# EAGLE design Dipudino (EAGLE 5.11)
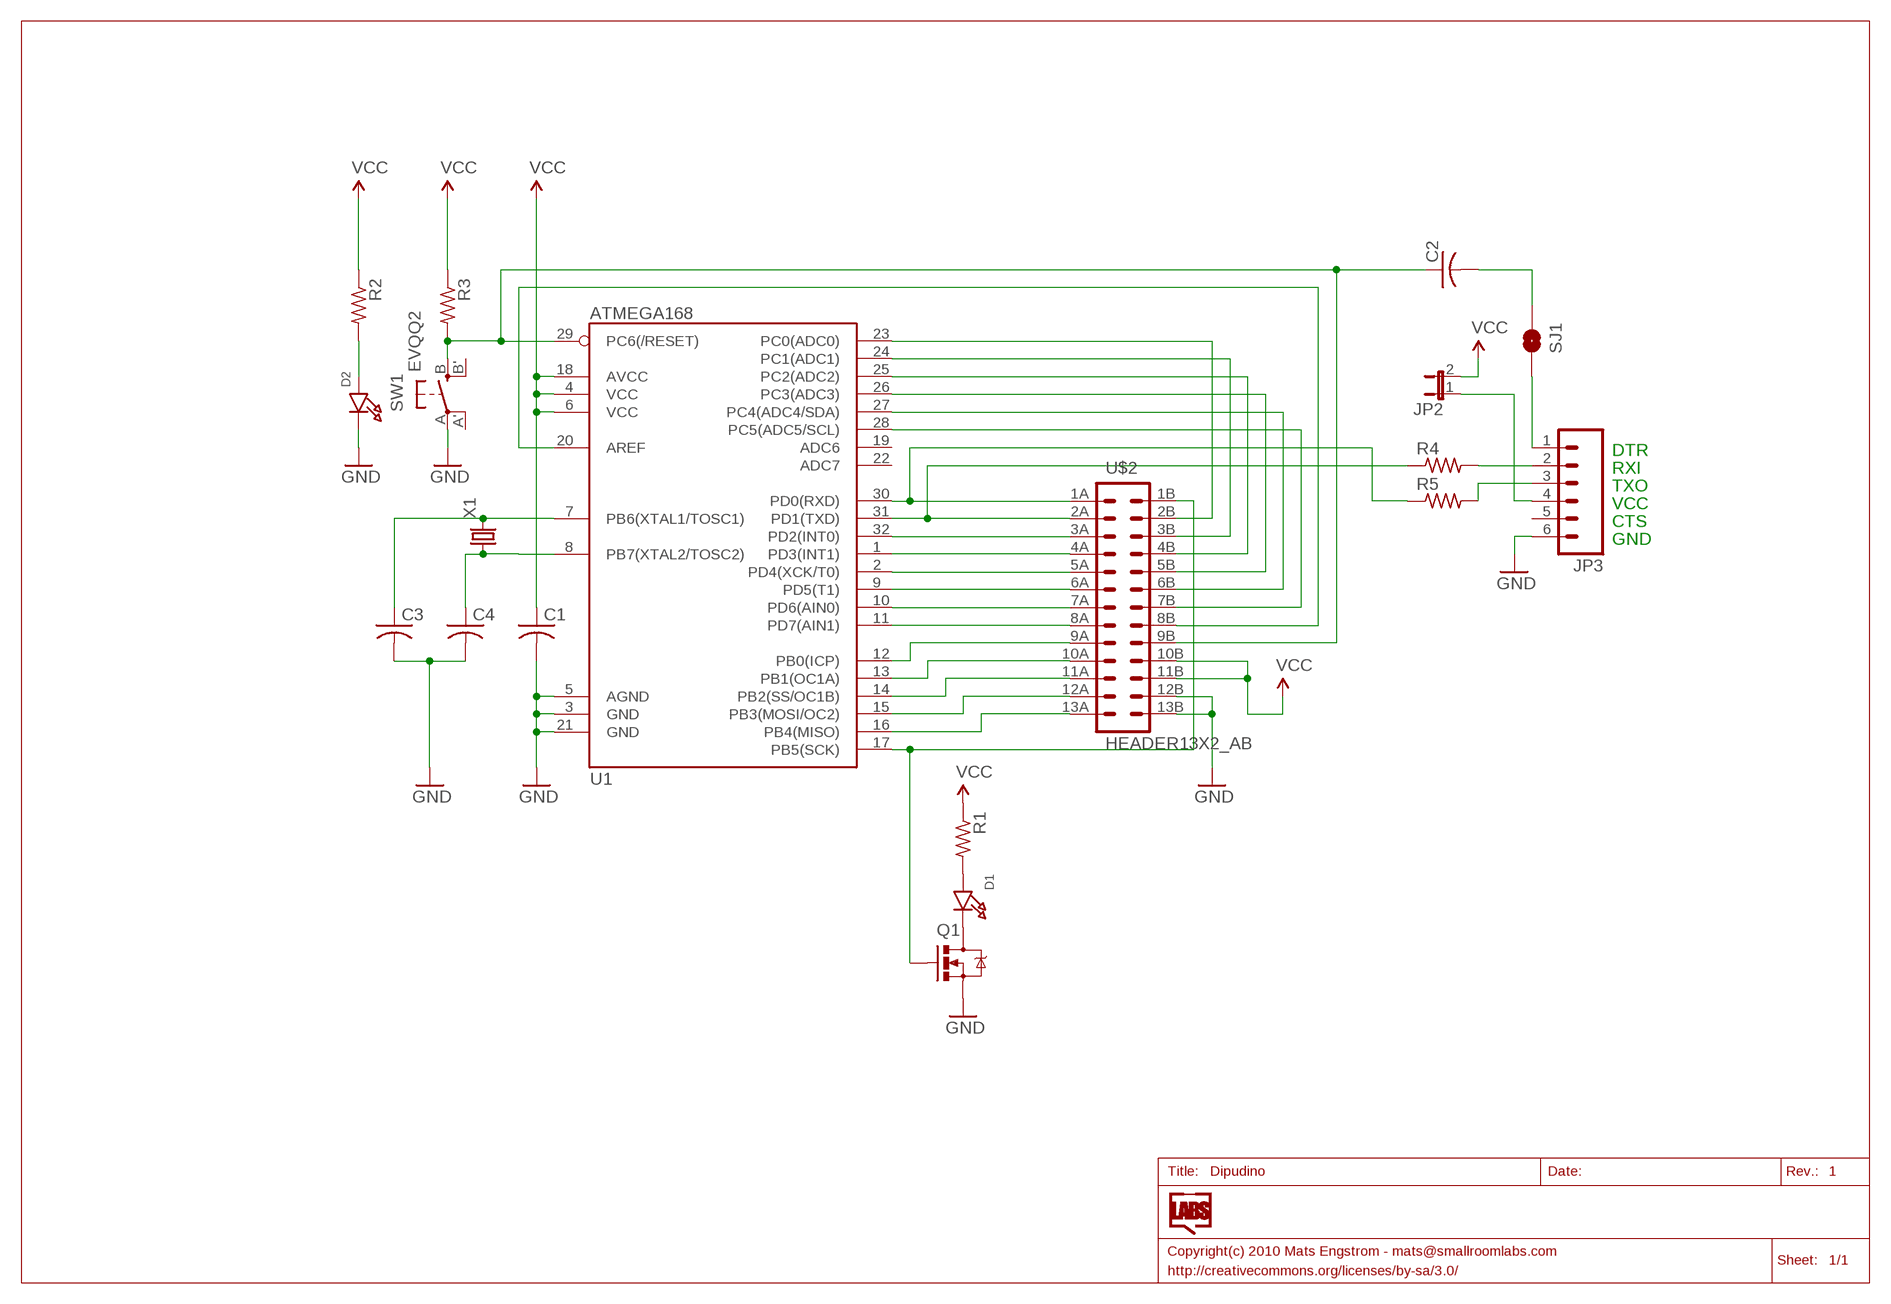
[diagram p0: schematic, sheet 1]

## Parts
C1  C-USC0805  [C0805]
C2  C-USC0805  [C0805]
C3  C-USC0805  [C0805]
C4  C-USC0805  [C0805]
D1  LEDSMD0805  [CHIPLED_0805]
D2  LEDSMD0805  [CHIPLED_0805]
JP2  JUMPER-2PTH  [1X02]
JP3  M06RA  [MOLEX-1X6-RA]
Q1  MOSFET-NCHANNELSMD  [SOT23-3]
R1  R-US_R0805W  [R0805W]
R2  R-US_R0805W  [R0805W]
R3  R-US_R0805W  [R0805W]
R4  R-US_R0805W  [R0805W]
R5  R-US_R0805W  [R0805W]
SJ1  SOLDERJUMPERTRACE  [SJ_2S-TRACE]
SW1  EVQQ2  [EVQ-Q2]
U1  ATMEGA168  [TQFP32-08]
U$2  HEADER13X2_AB  [HEADER2X13_TIGHT]
X1  CRYSTALSMD  [HC49UP]

## Nets
AREF: U1.20(AREF) U$2.8B
C5: C4.1 U1.8(PB7(XTAL2/TOSC2)) X1.1
EXTVCC: JP2.1 JP3.4
GND: C1.2 C3.2 C4.2 D2.C JP3.6 Q1.2(S) SW1.A(P) U1.3(GND) U1.5(AGND) U1.21(GND) U$2.12B U$2.13B
N$2: C2.2 SJ1.1
N$3: D2.A R2.2
N$4: D1.A R1.2
N$5: JP3.1 SJ1.2
N$8: JP3.2 R4.2
N$9: JP3.3 R5.2
N$32: D1.C Q1.3(D)
PB1-D9: U1.13(PB1(OC1A)) U$2.10A
PB2-D10: U1.14(PB2(SS/OC1B)) U$2.11A
PB3-D11: U1.15(PB3(MOSI/OC2)) U$2.12A
PB4-D12: U1.16(PB4(MISO)) U$2.13A
PB5-D13: Q1.1(G) U1.17(PB5(SCK)) U$2.1B
PBO-D8: U1.12(PB0(ICP)) U$2.9A
PC0-A0: U1.23(PC0(ADC0)) U$2.2B
PC1-A1: U1.24(PC1(ADC1)) U$2.3B
PC2-A2: U1.25(PC2(ADC2)) U$2.4B
PC3-A3: U1.26(PC3(ADC3)) U$2.5B
PC4-A4: U1.27(PC4(ADC4/SDA)) U$2.6B
PC5-A5: U1.28(PC5(ADC5/SCL)) U$2.7B
PD0-RXD: R5.1 U1.30(PD0(RXD)) U$2.1A
PD1-TXD: R4.1 U1.31(PD1(TXD)) U$2.2A
PD2: U1.32(PD2(INT0)) U$2.3A
PD3: U1.1(PD3(INT1)) U$2.4A
PD4: U1.2(PD4(XCK/T0)) U$2.5A
PD5: U1.9(PD5(T1)) U$2.6A
PD6: U1.10(PD6(AIN0)) U$2.7A
PD7: U1.11(PD7(AIN1)) U$2.8A
RESET: C2.1 R3.2 SW1.B(S) U1.29(PC6(/RESET)) U$2.9B
VCC: C1.1 JP2.2 R1.1 R2.1 R3.1 U1.4(VCC) U1.6(VCC) U1.18(AVCC) U$2.10B U$2.11B
XTAL1: C3.1 U1.7(PB6(XTAL1/TOSC1)) X1.2
Unconnected: JP3.5 SW1.A'(P1) SW1.B'(S1) U1.19(ADC6) U1.22(ADC7)

## Notes on the sheet
- DTR
- RXI
- TXO
- VCC
- CTS
- GND

## Library data of the parts
C1-C4 = adafruit:C-US: CAPACITOR, American symbol
D1 D2 = SmallRoomLabs:LED
JP2 = SparkFun:JUMPER-2: Jumper Basic 0.1" spaced jumper. Use with breakaway headers.
JP3 = SparkFun:M06: Header 6 Standard 6-pin 0.1" header. Use with straight break away headers (SKU : PRT-00116), right angle break away headers (PRT-00553), swiss pins (PRT-00743), machine pins (PRT-00117), and female headers (PRT-00115). Molex polarized connector foot print use with SKU : PRT-08094 with associated crimp pins and housings. NOTES ON THE VARIANTS LOCK and LOCK_LONGPADS... This footprint was designed to help hold the alignment of a through-hole component (i.e. 6-pin header) while soldering it into place. You may notice that each hole has been shifted either up or down by 0.005 of an inch from it's more standard position (which is a perfectly straight line). This slight alteration caused the pins (the squares in the middle) to touch the edges of the holes. Because they are alternating, it causes a "brace" to hold the component in place. 0.005 has proven to be the perfect amount of "off-center" position when using our standard breakaway headers. Although looks a little odd when you look at the bare footprint, once you have a header in there, the alteration is very hard to notice. Also, if you push a header all the way into place, it is covered up entirely on the bottom side. This idea of altering the position of holes to aid alignment will be further integrated into the Sparkfun Library for other footprints. It can help hold any component with 3 or more connection pins.
Q1 = SparkFun:MOSFET-NCHANNEL
R1-R5 = adafruit:R-US_: RESISTOR, American symbol
SJ1 = SparkFun:SOLDERJUMPER: Solder Jumper Standard SMD solder jumper. Used to automate production. Two varients : Normally Open and Normally Closed are the same, but have different paste layers. NC will have a large amount of paste and should jumper during reflow.
SW1 = adafruit:EVQQ2: SMT 6mm switch, EVQQ2 series http://www.ladyada.net/library/eagle
U1 = SparkFun:ATMEGA168
U$2 = SmallRoomLabs:HEADER13X2_AB
X1 = SparkFun:CRYSTAL: Crystals Various standard crystals. Proven footprints. Spark Fun Electronics SKU : COM-00534

## Net classes
0 default: width 0.178 mm, clearance 0.178 mm

## Board
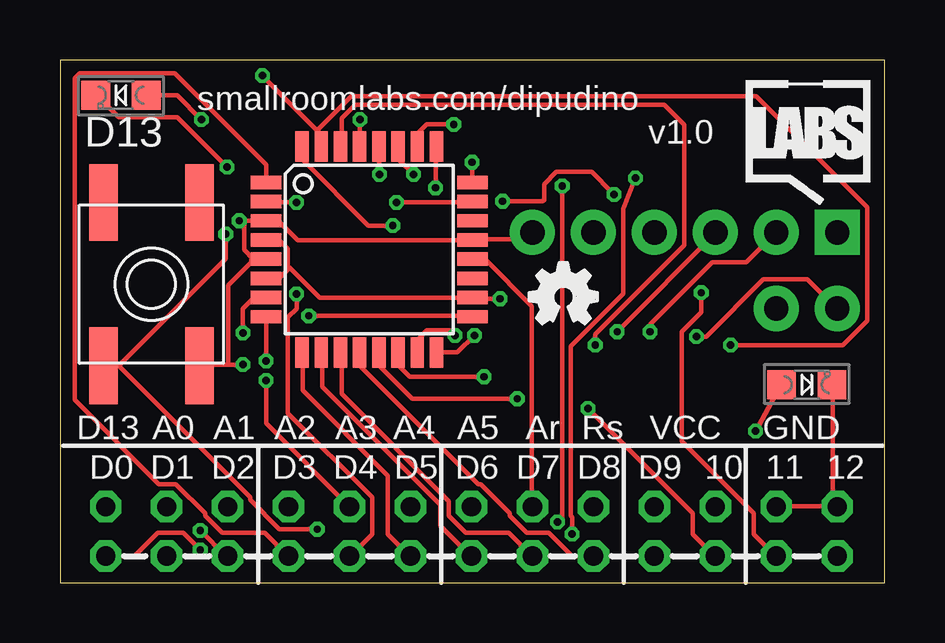
[diagram p1: board, top side]
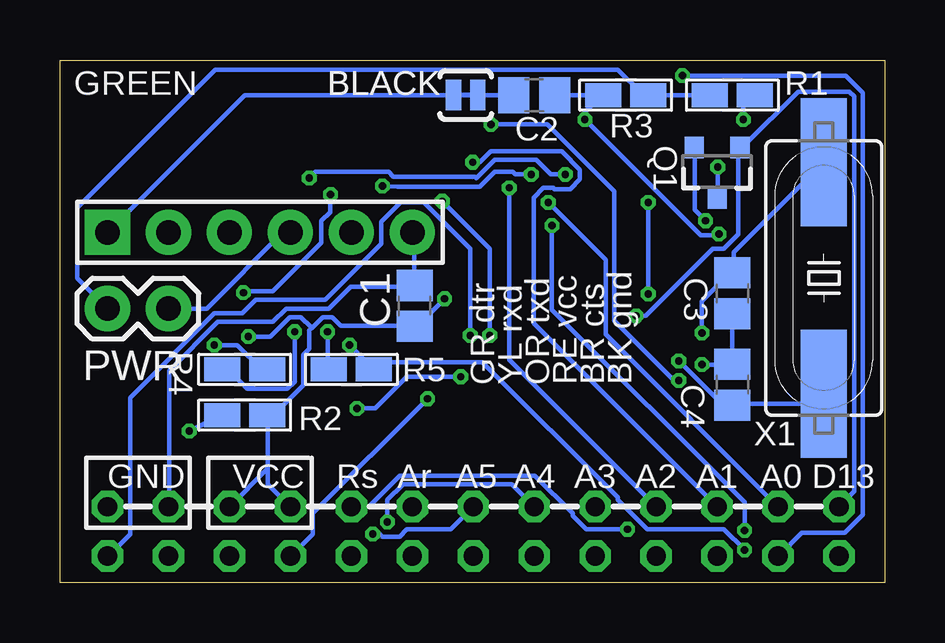
[diagram p2: board, bottom side, seen from below]

Size 34.37 x 21.79 mm. Coordinates in mm from the lower left corner, seen from the top.
Outline: 0,0 34.37,0 34.37,21.79 0,21.79 0,0
Copper layers (1*16): Top 0.035mm / dielectric 1.5mm / Bottom 0.035mm
Design rules "ITead_rule": minimum track width 6mil, minimum drill 12mil, track to track 6mil, track to pad 6mil, pad to pad 6mil, via to via 6mil, smd to smd 0mil, copper to edge 10mil, drill to drill 10mil, minimum pad ring 10mil, minimum via ring 6mil, stop-mask expansion 2mil, vias tented up to drill 100mil, thermal gap 10mil
vRestrict: area -1.3,4.1 to 34.3,6.9

### Footprints (pad centres in the part's own frame; a part is rotated, then mirrored left to right if it is on the bottom)
C0805 = smd 1.3 x 1.5: 1 -0.85,0; 2 0.85,0
CHIPLED_0805 = smd 1.2 x 1.2: A 0,-1.05; C 0,1.05
1X02 = drill 1.016 pad 1.88 round: 1 -1.27,0; 2 1.27,0
MOLEX-1X6-RA = drill 1.016 pad 1.88 square: 1 -6.35,-3.81 | drill 1.016 pad 1.88 round: 2 -3.81,-3.81; 3 -1.27,-3.81; 4 1.27,-3.81; 5 3.81,-3.81; 6 6.35,-3.81
SOT23-3 = smd 0.8 x 0.9: 1 -0.95,-1; 2 0.95,-1; 3 0,1.1
R0805W = smd 1.5 x 1: 1 -0.94,0; 2 0.94,0
SJ_2S-TRACE = smd 0.635 x 1.27: 1 -0.508,0; 2 0.508,0
EVQ-Q2 = smd 3.2 x 1.2: A -3.4,-2; A' 3.4,-2; B -3.4,2; B' 3.4,2
TQFP32-08 = smd 1.27 x 0.559: 1 -4.293,2.8; 2 -4.293,2; 3 -4.293,1.2; 4 -4.293,0.4; 5 -4.293,-0.4; 6 -4.293,-1.2; 7 -4.293,-2; 8 -4.293,-2.8; 17 4.293,-2.8; 18 4.293,-2; 19 4.293,-1.2; 20 4.293,-0.4; 21 4.293,0.4; 22 4.293,1.2; 23 4.293,2; 24 4.293,2.8 | smd 0.559 x 1.27: 9 -2.8,-4.293; 10 -2,-4.293; 11 -1.2,-4.293; 12 -0.4,-4.293; 13 0.4,-4.293; 14 1.2,-4.293; 15 2,-4.293; 16 2.8,-4.293; 25 2.8,4.293; 26 2,4.293; 27 1.2,4.293; 28 0.4,4.293; 29 -0.4,4.293; 30 -1.2,4.293; 31 -2,4.293; 32 -2.8,4.293
HEADER2X13_TIGHT = drill 0.8 octagon: 1A -15.24,-1.041; 1B -15.24,1.016; 2A -12.7,-1.041; 2B -12.7,1.016; 3A -10.16,-1.041; 3B -10.16,1.016; 4A -7.62,-1.041; 4B -7.62,1.016; 5A -5.08,-1.041; 5B -5.08,1.016; 6A -2.54,-1.041; 6B -2.54,1.016; 7A 0,-1.041; 7B 0,1.016; 8A 2.54,-1.041; 8B 2.54,1.016; 9A 5.08,-1.041; 9B 5.08,1.016; 10A 7.62,-1.041; 10B 7.62,1.016; 11A 10.16,-1.041; 11B 10.16,1.016; 12A 12.7,-1.041; 12B 12.7,1.016; 13A 15.24,-1.041; 13B 15.24,1.016
HC49UP = smd 5.334 x 1.93: 1 -4.826,0; 2 4.826,0

### Placement (x,y rotation side)
C1  19.59,11.54 90 bottom
C2  14.61,20.32 180 bottom
C3  6.35,12.06 270 bottom
C4  6.35,8.26 90 bottom
D1  2.54,20.32 90 top
D2  31.11,8.26 270 top
JP2  31.11,11.43 180 bottom
JP3  26.04,18.41 0 bottom
Q1  6.99,17.14 180 bottom
R1  6.35,20.32 0 bottom
R2  26.67,6.99 180 bottom
R3  10.79,20.32 180 bottom
R4  26.67,8.89 180 bottom
R5  22.23,8.89 180 bottom
SJ1  17.46,20.32 180 bottom
SW1  3.81,12.45 90 top
U1  12.89,13.89 0 top
U$2  17.14,2.16 0 top
U$4  [OSHW_FILLX100_NOTEXT]  19.56,10.79 0 top
U$5  [SRL-LOGO-TPLACE-5MM]  28.57,15.75 0 top
X1  2.54,12.7 90 bottom

### Tracks (layer width: path | path; a pad name or v marks a point on that pad's centre or on a via)
AREF
  Top 0.178: U1.20 17.22,13.46 17.73,13.46 19.66,11.53 19.66,3.2 U$2.8B
C5  (via drill 0.3)
  Top 0.178: v8.59,9.25 8.59,11.07 U1.8
  Bottom 0.178: v8.59,9.25 6.76,7.42 C4.1 6.3,7.47 2.95,7.47 X1.1
EXTVCC
  Bottom 0.178: JP3.4 24.79,14.58 25.09,14.58 28.25,11.43 29.82,11.43 JP2.1
GND  (via drill 0.3)
  Top 0.178: D2.C 32.21,8.23 32.21,3.35 32.36,3.2 U$2.13B 32.26,3.2 29.87,3.2 U$2.12B | JP3.6 19.66,14.58 19.41,14.33 17.22,14.33 U1.21 17.12,14.28 9.91,14.28 9.14,15.04 8.64,15.04 U1.3 v7.47,15.09 7.67,15.04 7.67,13.87 8.03,13.51 8.59,13.51 U1.5 7.98,13.46 7.98,13.36 7.01,12.39 7.01,9.14 7.01,9.09 | 7.01,9.09 5.84,9.09 SW1.A | v7.62,9.09 7.01,9.09
  Bottom 0.178: v7.47,15.09 7.92,15.54 7.92,18.14 Q1.2 | C3.2 6.35,11.18 6.35,9.14 C4.2 6.4,9.09 v7.62,9.09 | U$2.12B 29.82,3.2 29.82,8.84 27.79,10.87 25.5,10.87 24.94,11.43 24.89,11.43 23.16,11.43 22.25,12.34 19.66,12.34 C1.2 19.61,12.39 19.61,14.53 19.66,14.58 JP3.6
N$2
  Bottom 0.178: SJ1.1 C2.2
N$3  (via drill 0.3)
  Top 0.178: v28.98,6.33 30.02,8.23 D2.A
  Bottom 0.178: v28.98,6.33 27.64,7.01 R2.2
N$4  (via drill 0.3)
  Top 0.178: v5.89,19.3 4.88,20.32 3.61,20.32 D1.A
  Bottom 0.178: v5.89,19.3 5.89,19.86 5.44,20.32 R1.2
N$5
  Bottom 0.178: SJ1.2 26.67,20.32 JP3.1
N$8  (via drill 0.3)
  Top 0.178: v24.59,10.46 24.59,10.77 27.18,13.36 28.6,13.36 29.82,14.58 JP3.2
  Bottom 0.178: v24.59,10.46 24.59,8.38 24.89,8.08 26.57,8.08 27.38,8.89 27.58,8.89 R4.2
N$9  (via drill 0.3)
  Top 0.178: v23.22,10.46 27.33,14.58 JP3.3
  Bottom 0.178: v23.22,10.46 23.22,8.89 R5.2
N$32  (via drill 0.3)
  Top 0.178: v6.96,17.32 4.88,19.41 2.44,19.41 1.52,20.32 D1.C
  Bottom 0.178: v6.96,17.32 6.96,16.05 Q1.3
PB1-D9  (via drill 0.3)
  Top 0.178: v19.05,7.67 14.68,7.67 13.31,9.04 13.31,9.55 U1.13
  Bottom 0.178: v19.05,7.67 23.82,2.9 23.82,2.03 24.74,1.12 U$2.10A
PB2-D10  (via drill 0.3)
  Top 0.178: v17.67,8.59 14.58,8.59 14.12,9.04 14.12,9.55 U1.14 | v22,7.26 26.36,2.9 26.36,2.03 27.28,1.12 U$2.11A
  Bottom 0.178: v17.67,8.59 19.91,8.59 21.23,7.26 v22,7.26
PB3-D11  (via drill 0.3)
  Top 0.178: v16.46,10.31 16.26,10.52 15.29,10.52 14.94,10.16 14.94,9.6 U1.15 | v18.44,15.9 20.12,15.9 20.17,15.95 20.17,16.61 20.68,17.12 22.15,17.12 23.01,16.26 v23.09,16.18 23.06,16.2 | v26.72,12.09 26.72,11.28 25.91,10.46 25.91,5.89 28.91,2.9 28.91,2.03 29.82,1.12 U$2.12A
  Bottom 0.178: v16.46,10.31 16.46,13.92 v18.44,15.9 | v26.72,12.09 26.67,12.14 25.5,12.14 23.52,14.12 23.47,14.17 23.47,15.09 23.11,15.44 23.11,16.15 v23.09,16.18
PB4-D12  (via drill 0.3)
  Top 0.178: v17.27,10.31 16.56,9.6 15.7,9.6 U1.16
  Bottom 0.178: v17.27,10.31 17.27,13.92 19.2,15.85 20.17,15.85 20.98,15.04 20.98,14.12 23.32,11.79 26.21,11.79 26.77,11.23 27.94,11.23 31.45,7.72 31.45,2.03 32.36,1.12 U$2.13A
PB5-D13  (via drill 0.3)
  Top 0.178: v10.36,11.12 17.17,11.12 U1.17
  Bottom 0.178: U$2.1B 1.88,3.2 1.27,3.81 1.27,20.27 1.47,20.47 3.61,20.47 5.89,18.19 5.99,18.19 Q1.1 6.1,18.09 6.1,14.53 6.71,13.92 7.16,13.92 9.96,11.12 v10.36,11.12
PBO-D8
  Top 0.178: U1.12 12.5,9.55 12.5,9.04 17.42,4.12 17.53,4.12 18.75,2.9 18.75,2.79 19.46,2.08 20.37,2.08 21.34,1.12 22.2,1.12 U$2.9A
PC0-A0  (via drill 0.3)
  Top 0.178: v14.02,15.85 17.17,15.85 U1.23
  Bottom 0.178: v14.02,15.85 11.63,13.46 11.63,10.36 4.47,3.2 U$2.2B
PC1-A1  (via drill 0.3)
  Top 0.178: v17.17,17.53 17.17,16.71 U1.24
  Bottom 0.178: v17.17,17.53 16.87,17.53 16.41,17.98 13.46,17.98 12.7,17.22 12.7,16.82 13.11,16.41 13.77,16.41 13.82,16.46 14.22,16.46 14.63,16.05 14.63,10.82 7.01,3.2 U$2.3B
PC2-A2  (via drill 0.3)
  Top 0.178: v15.65,16.46 15.65,18.14 U1.25
  Bottom 0.178: v15.65,16.46 15.65,9.3 9.55,3.2 U$2.4B
PC3-A3  (via drill 0.3)
  Top 0.178: v16.41,19.1 15.29,19.1 14.94,18.75 14.94,18.19 U1.26 | v8.59,8.43 8.59,6.66 12.04,3.2 U$2.5B
  Bottom 0.178: v16.41,19.1 14.07,19.1 11.28,16.31 11.28,10.92 8.79,8.43 v8.59,8.43
PC4-A4  (via drill 0.3)
  Top 0.178: v14.73,17.02 14.12,17.63 14.12,18.14 U1.27 | v20.93,16.54 20.93,2.74 v20.73,2.54
  Bottom 0.178: v14.73,17.02 15.39,17.02 15.49,17.12 16.26,17.12 16.87,16.51 20.32,16.51 v20.93,16.54 | v20.73,2.54 20.73,3.45 20.07,4.12 15.54,4.12 14.63,3.2 U$2.6B
PC5-A5  (via drill 0.3)
  Top 0.178: v13.31,17.02 13.31,18.14 U1.28 | v23.98,16.87 23.47,15.6 23.47,12.04 21.29,9.86 21.29,2.79 21.34,2.74 v21.34,2.03
  Bottom 0.178: v13.31,17.02 13.92,17.02 14.53,17.63 16.26,17.63 17.02,16.87 17.07,16.92 20.47,16.92 20.68,17.12 23.72,17.12 v23.98,16.87 | v21.34,2.03 21.03,2.03 20.93,1.93 20.22,1.93 19.91,2.23 18.09,2.23 17.17,3.15 U$2.7B
PD0-RXD  (via drill 0.3)
  Top 0.178: v22.3,9.91 22.3,10.36 26.01,14.07 26.01,19.09 25.18,19.91 12.29,19.91 11.73,19.36 11.73,18.19 U1.30 | v5.84,1.37 5.13,2.08 4.06,2.08 3.1,1.12 1.93,1.12 U$2.1A
  Bottom 0.178: R5.1 v22.3,9.91 | R5.1 | v5.84,1.37 6.71,2.23 9.91,2.23 11.12,3.45 11.12,3.56 16.76,9.2 21.49,9.2 R5.1
PD1-TXD  (via drill 0.3)
  Top 0.178: v8.43,21.13 10.72,18.85 | 10.72,18.85 10.87,18.69 10.87,18.19 U1.31 | v27.94,9.91 32.61,9.91 33.63,10.92 33.63,15.65 29.01,20.27 12.14,20.27 10.77,18.9 10.72,18.85
  Bottom 0.178: v8.43,21.13 1.63,21.13 0.91,20.42 0.91,2.85 1.68,2.08 3.45,2.08 4.42,1.12 U$2.2A | v27.94,9.91 26.98,9.91 25.96,8.89 25.76,8.89 R4.1
PD2  (via drill 0.3)
  Top 0.178: v13.87,14.88 12.85,14.88 10.11,17.63 10.11,18.14 U1.32 | v5.84,2.18 6.91,1.12 6.96,1.12 U$2.3A
  Bottom 0.178: v13.87,14.88 13.87,11.38 5.84,3.35 v5.84,2.18
PD3
  Top 0.178: U1.1 8.59,16.71 8.59,17.42 4.78,21.23 0.81,21.23 0.61,21.03 0.61,7.62 4.12,4.12 4.83,4.12 6.04,2.9 6.04,2.79 6.76,2.08 8.53,2.08 9.5,1.12 U$2.4A
PD4  (via drill 0.3)
  Top 0.178: v9.86,15.85 8.64,15.85 U1.2 | v9.86,12.04 9.86,11.43 9.5,11.07 9.5,7.06 13.01,3.56 13.01,2.03 12.09,1.12 U$2.5A
  Bottom 0.178: v9.86,12.04 v9.86,15.85
PD5
  Top 0.178: U1.9 10.11,9.55 10.11,8.03 13.66,4.47 13.66,2.03 14.58,1.12 U$2.6A
PD6
  Top 0.178: U1.10 10.92,9.55 10.92,8.18 15.85,3.25 15.85,2.39 17.12,1.12 U$2.7A
PD7
  Top 0.178: U1.11 11.73,9.55 11.73,7.87 16.2,3.4 16.2,2.79 16.92,2.08 18.69,2.08 19.66,1.12 U$2.8A
RESET  (via drill 0.3)
  Top 0.178: v12.5,19.3 U1.29 | v10.72,2.23 9.14,2.23 7.92,3.45 7.92,3.56 2.44,9.04 | 2.44,9.04 1.83,9.04 SW1.B | v6.91,14.53 6.91,13.51 2.49,9.09 2.44,9.04
  Bottom 0.178: C2.1 13.72,20.32 11.89,20.32 R3.2 11.79,20.32 12.5,19.61 v12.5,19.3 12.45,19.25 7.67,14.48 6.96,14.48 v6.91,14.53 | v10.72,2.23 12.45,2.23 13.01,2.79 13.01,2.9 14.58,4.47 20.22,4.47 21.49,3.2 22.2,3.2 U$2.9B
VCC  (via drill 0.3)
  Top 0.178: 9.5,13.16 9.5,13.92 9.14,14.28 8.64,14.28 U1.4 | 9.5,13.16 9.5,13.06 9.14,12.7 8.64,12.7 U1.6 | 9.5,13.16 9.55,13.16 10.82,11.89 U1.18 17.22,11.84 v18.34,11.84 | v26.52,10.26 26.92,10.26 29.31,12.65 31.14,12.65 32.36,11.43 JP2.2
  Bottom 0.178: 25.7,4.72 25.7,4.12 24.79,3.2 U$2.10B | 25.7,4.72 25.7,6.96 R2.1 25.65,6.81 24.23,8.23 24.23,9.5 23.98,9.75 23.98,10.52 23.88,10.62 | U$2.11B 27.28,3.2 25.76,4.72 25.7,4.72 | R1.1 7.32,20.32 9.8,20.32 R3.1 9.91,20.37 10.11,20.37 11.12,21.39 24.79,21.39 27.89,21.39 33.66,15.62 33.66,12.7 JP2.2 32.36,11.43 | v18.34,11.84 19.46,10.72 19.56,10.72 C1.1 19.66,10.72 22.66,10.72 23.01,11.07 23.42,11.07 23.88,10.62 | v26.52,10.26 25.6,10.26 24.79,11.07 24.33,11.07 23.93,10.67 23.88,10.62
XTAL1  (via drill 0.3)
  Top 0.178: v7.62,10.41 7.62,11.43 8.03,11.84 8.59,11.84 U1.7
  Bottom 0.178: v7.62,10.41 7.62,11.73 6.45,12.9 C3.1 6.3,12.95 6.3,13.77 X1.2

### Text on the board
tPlace: smallroomlabs.com/dipudino | D13 | v1.0 | D13 | A0 | A1 | A2 | A3 | A4 | A5 | Ar | Rs | VCC | GND | D0 | D1 | D2 | D3 | D4 | D5 | D6 | D7 | D8 | D9 | 10 | 11 | 12
bPlace: BLACK | BLACK | GREEN | BK gnd | BR cts | RE vcc | OR txd | YL rxd | GR dtr | PWR | D13 | A0 | A1 | A2 | A3 | A4 | A5 | Ar | Rs | VCC | GND